# EAGLE board RectangularThing-SOICs (EAGLE 7.7.0), part 1 of 2
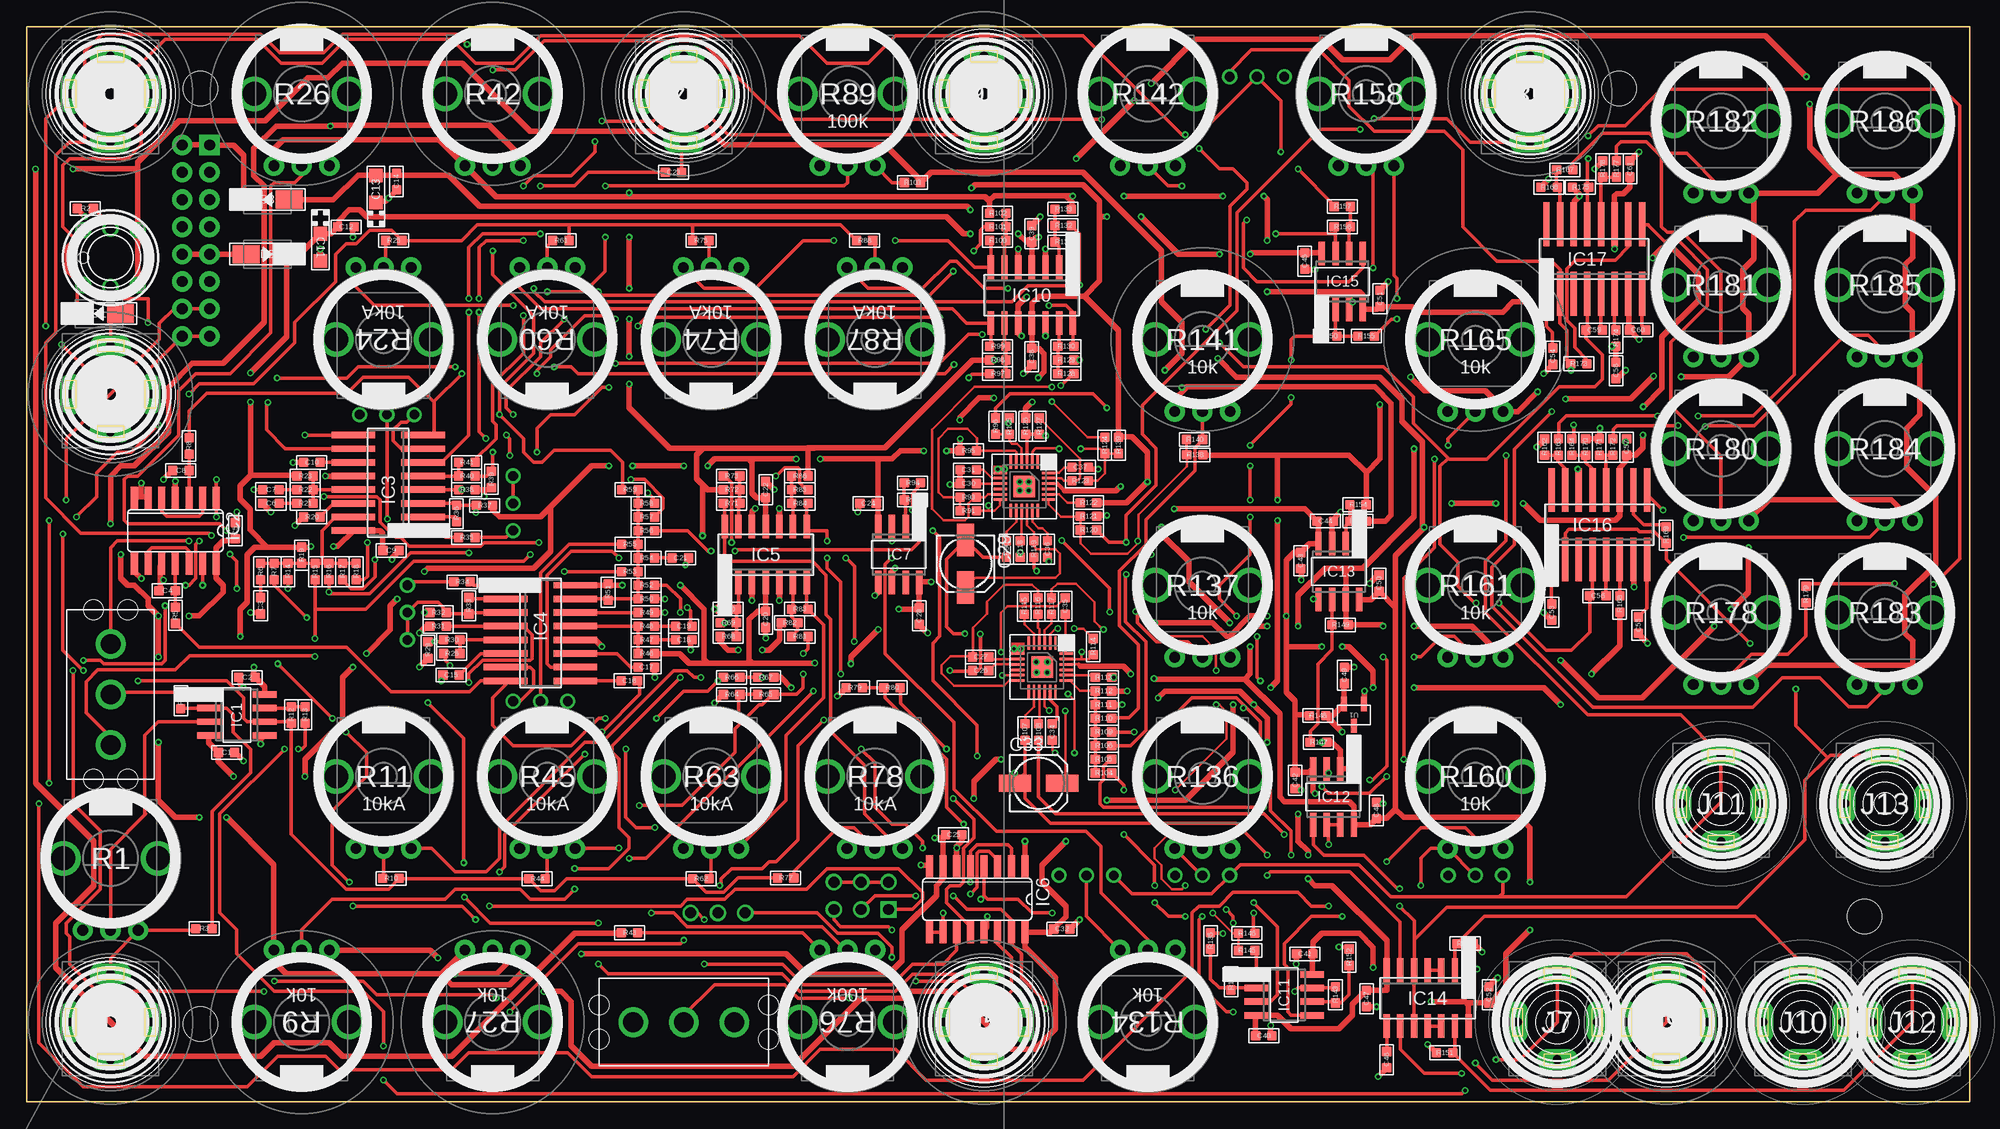
[diagram p9: board, top side]
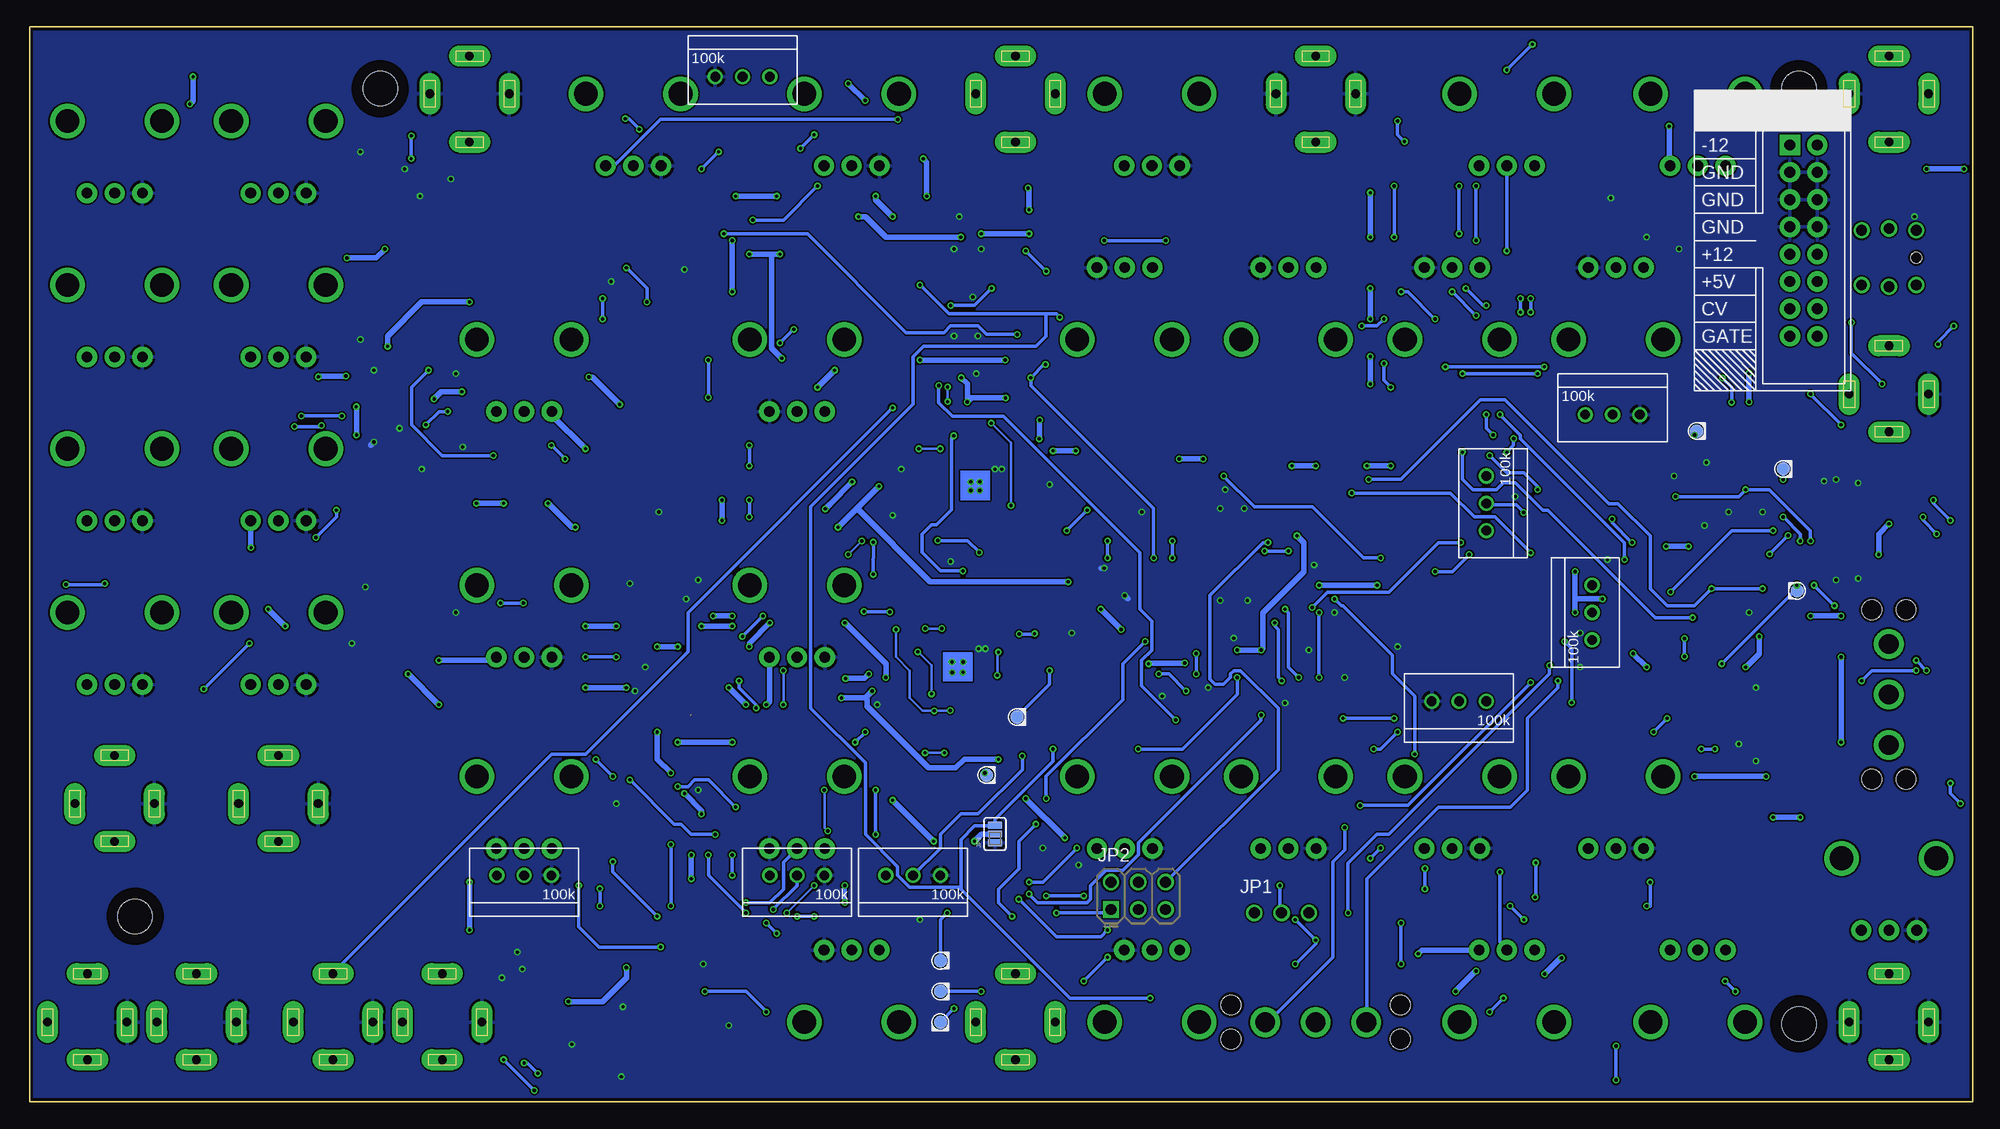
[diagram p10: board, bottom side, seen from below]

Size 180.78 x 100 mm. Coordinates in mm from the lower left corner, seen from the top.
Copper layers (1*16): Top 0.035mm / dielectric 1.5mm / Bottom 0.035mm
Design rules "ITEADstudio_DRC": minimum track width 6mil, minimum drill 12mil, track to track 6mil, track to pad 6mil, pad to pad 6mil, via to via 6mil, smd to smd 0mil, copper to edge 10mil, drill to drill 10mil, minimum pad ring 10mil, minimum via ring 6mil, stop-mask expansion 2mil, vias tented up to drill 100mil, thermal gap 10mil
Net classes: 0 default: width 0.305 mm; 1 power: width 0.508 mm; 2 nearfilter: width 0.254 mm; 3 groundplane: width 0.203 mm, clearance 0.203 mm

## Footprints (pad centres in the part's own frame; a part is rotated, then mirrored left to right if it is on the bottom)
C0603 = smd 0.889 x 0.889: 1 -0.762,0; 2 0.762,0
CASE-A_3216 = smd 1.27 x 1.27: + -1.27,0; - 1.27,0
153CLV-0505 = smd 3 x 1.6: + 2.2,0; - -2.2,0
DO-214AC = smd 2.5 x 1.7: 1 -2,0; 2 2,0
3.2-NOMARKINGS-SMALLSAFEZONE = hole 3.2: 0,0
SO08 = smd 0.6 x 2.2: 1 -1.905,-2.6; 2 -0.635,-2.6; 3 0.635,-2.6; 4 1.905,-2.6; 5 1.905,2.6; 6 0.635,2.6; 7 -0.635,2.6; 8 -1.905,2.6
SO14 = smd 0.66 x 2.032: 1 -3.81,-3.073; 2 -2.54,-3.073; 3 -1.27,-3.073; 4 0,-3.073; 5 1.27,-3.073; 6 2.54,-3.073; 7 3.81,-3.073; 8 3.81,3.073; 9 2.54,3.073; 10 1.27,3.073; 11 0,3.073; 12 -1.27,3.073; 13 -2.54,3.073; 14 -3.81,3.073
SO16 = smd 0.6 x 4.064: 1 -4.445,-3.235; 2 -3.175,-3.235; 3 -1.905,-3.235; 4 -0.635,-3.235; 5 0.635,-3.235; 6 1.905,-3.235; 7 3.175,-3.235; 8 4.445,-3.235; 9 4.445,3.235; 10 3.175,3.235; 11 1.905,3.235; 12 0.635,3.235; 13 -0.635,3.235; 14 -1.905,3.235; 15 -3.175,3.235; 16 -4.445,3.235
SO14' = smd 0.6 x 2.2: 1 -3.81,-2.6; 2 -2.54,-2.6; 3 -1.27,-2.6; 4 0,-2.6; 5 1.27,-2.6; 6 2.54,-2.6; 7 3.81,-2.6; 8 3.81,2.6; 9 2.54,2.6; 10 1.27,2.6; 11 0,2.6; 12 -1.27,2.6; 13 -2.54,2.6; 14 -3.81,2.6
SO16' = smd 0.66 x 2.032: 1 -4.445,-3.073; 2 -3.175,-3.073; 3 -1.905,-3.073; 4 -0.635,-3.073; 5 0.635,-3.073; 6 1.905,-3.073; 7 3.175,-3.073; 8 4.445,-3.073; 9 4.445,3.073; 10 3.175,3.073; 11 1.905,3.073; 12 0.635,3.073; 13 -0.635,3.073; 14 -1.905,3.073; 15 -3.175,3.073; 16 -4.445,3.073
QFN24 = smd 1.25 x 0.23: P$1 -2.25,1.25; P$2 -2.25,0.75; P$3 -2.25,0.25; P$4 -2.25,-0.25; P$5 -2.25,-0.75; P$6 -2.25,-1.25; P$13 2.25,-1.25; P$14 2.25,-0.75; P$15 2.25,-0.25; P$16 2.25,0.25; P$17 2.25,0.75; P$18 2.25,1.25 | smd 0.23 x 1.25: P$7 -1.25,-2.25; P$8 -0.75,-2.25; P$9 -0.25,-2.25; P$10 0.25,-2.25; P$11 0.75,-2.25; P$12 1.25,-2.25; P$19 1.25,2.25; P$20 0.75,2.25; P$21 0.25,2.25; P$22 -0.25,2.25; P$23 -0.75,2.25; P$24 -1.25,2.25 | smd 2 x 2: PAD 0,0
3.5MM-JACK-SWITCH-13MM-INPUT = drill 0.8 pad 1.93 long: RING@3 -3.7,0; SECOND@3 0,-3.5; SWITCH@3 3.7,0; TIP@3 0,4.5
3.5MM-JACK-SWITCH-13MM-OUTPUT = drill 0.8 pad 1.93 long: RING@3 -3.7,0; SECOND@3 0,-3.5; SWITCH@3 3.7,0; TIP@3 0,4.5
POWER_16_SHROUDED = drill 1.016 pad 1.88 square: 1 -8.89,-1.27 | drill 1.016 pad 1.88: 2 -8.89,1.27; 3 -6.35,-1.27; 4 -6.35,1.27; 5 -3.81,-1.27; 6 -3.81,1.27; 7 -1.27,-1.27; 8 -1.27,1.27; 9 1.27,-1.27; 10 1.27,1.27; 11 3.81,-1.27; 12 3.81,1.27; 13 6.35,-1.27; 14 6.35,1.27; 15 8.89,-1.27; 16 8.89,1.27
1X03_NO_SILK = drill 1.016: 1 0,0; 2 2.54,0; 3 5.08,0
2X3-NS = drill 1.016 square: 1 -2.54,-1.27 | drill 1.016: 2 -2.54,1.27; 3 0,-1.27; 4 0,1.27; 5 2.54,-1.27; 6 2.54,1.27
SJ_3_PASTE1&2 = smd 0.635 x 1.27: 1 -0.813,0; 2 0,0; 3 0.813,0
OG-POTS_ALPS_POT_VERTICAL = drill 1 pad 1.88: P$1 -2.58,-6.7; P$2 0,-6.7; P$3 2.58,-6.7 | drill 2.2 pad 3.175: P$4 4.4,0; P$5 -4.4,0
R0603 = smd 0.889 x 0.889: 1 -0.762,0; 2 0.762,0
OG-POTS_ALPS_POT_VERTICAL_WITHBIGKNOB = drill 1 pad 1.88: P$1 -2.58,-6.7; P$2 0,-6.7; P$3 2.58,-6.7 | drill 2.2 pad 3.175: P$4 4.4,0; P$5 -4.4,0
TRIMPOT = drill 0.9: P$1 -2.54,0; P$2 0,0; P$3 2.54,0
MULTICOMP1MS-ONOFFON = drill 1.85: 1 -4.7,0; 2 0,0; 3 4.7,0 | hole 1.85: -7.875,1.59; -7.875,-1.59; 7.875,1.59; 7.875,-1.59
PB6149L = drill 1: 1 2.54,2.54; 2 2.54,-2.54; 3 -2.54,2.54; 4 -2.54,-2.54; LEDNEG 0,-2.7; LEDPOS 0,2.7 | hole 1: 2.54,0
PAD.03X.05 = smd 1.27 x 1.27: P$1 0,0
SOT95P237X112-3N = smd 1.321 x 0.559: 1 -1.016,0.94; 2 -1.016,-0.94; 3 1.016,0

## Placement (x,y rotation side)
C1  100nF  [C0603]  18.58,32.5 0 top
C2  100nF  [C0603]  20.49,39.48 0 top
C3  0.01uF  [C0603]  21.76,46.15 90 top
C4  33p  [C0603]  13.06,47.55 180 top
C5  100nF  [C0603]  19.41,53.13 90 top
C6  0.01uF  [C0603]  22.71,55.67 0 top
C7  100nF  [C0603]  22.71,56.94 180 top
C8  33p  [C0603]  14.33,58.72 180 top
C9  100nF  [C0603]  33.89,51.29 180 top
C10  1000pF  [C0603]  26.52,59.48 180 top
C11  10uF  [CASE-A_3216]  27.31,79.49 270 top
C12  100nF  [C0603]  29.7,81.39 0 top
C13  10uF  [CASE-A_3216]  32.49,84.92 90 top
C14  100nF  [C0603]  34.39,85.61 270 top
C15  0.001uF  [C0603]  39.47,39.7 180 top
C16  0.001uF  [C0603]  56.05,39.16 180 top
C17  1000pF  [C0603]  57.64,40.43 0 top
C18  0.01uF  [C0603]  61.13,42.97 180 top
C19  100nF  [C0603]  61.13,44.24 0 top
C20  100nF  [C0603]  68.75,44.88 270 top
C21  0.01uF  [C0603]  60.81,50.59 180 top
C22  100nF  [C0603]  68.75,56.94 90 top
C23  0.001uF  [C0603]  60.18,86.47 0 top
C24  100nF  [C0603]  78.27,55.67 180 top
C25  100nF  [C0603]  86.24,24.84 180 top
C26  300pF  [C0603]  88.75,40.12 0 top
C27  300pF  [C0603]  88.75,41.39 180 top
C28  100nF  [C0603]  83.04,45.2 90 top
C29  1uF  [153CLV-0505]  87.35,50.05 270 top
C30  300pF  [C0603]  87.61,57.52 0 top
C31  300pF  [C0603]  87.61,58.79 0 top
C32  100nF  [C0603]  96.31,16.08 0 top
C33  1uF  [153CLV-0505]  94.15,29.64 0 top
C34  300pF  [C0603]  95.42,34.4 270 top
C35  300pF  [C0603]  96.62,46.12 90 top
C36  300pF  [C0603]  94.97,51.42 270 top
C37  300pF  [C0603]  98.02,59.04 0 top
C38  100nF  [C0603]  93.51,69.33 270 top
C39  100nF  [C0603]  93.51,80.76 90 top
C40  100nF  [C0603]  115.1,6.14 0 top
C41  100nF  [C0603]  118.91,13.76 0 top
C42  100nF  [C0603]  118.02,29.89 270 top
C43  100nF  [C0603]  118.53,50.34 270 top
C44  100nF  [C0603]  120.82,54.02 0 top
C45  100nF  [C0603]  118.91,78.22 90 top
C46  5nF  [C0603]  126.53,3.92 270 top
C47  100nF  [C0603]  124.66,9.6 270 top
C48  100nF  [C0603]  125.58,27.1 270 top
C49  100nF  [C0603]  122.6,39.67 270 top
C50  100nF  [C0603]  125.83,48.24 270 top
C51  100nF  [C0603]  125.9,74.72 90 top
C52  100nF  [C0603]  136.06,9.95 270 top
C53  0.039uF  [C0603]  141.9,45.55 90 top
C54  0.039uF  [C0603]  142,69.36 90 top
C55  0.02uF  [C0603]  149.96,44.34 90 top
C56  0.02uF  [C0603]  146.19,47.07 0 top
C57  100nF  [C0603]  148.85,60.91 270 top
C58  100nF  [C0603]  147.87,68.02 90 top
C59  0.02uF  [C0603]  145.84,71.8 0 top
C60  0.02uF  [C0603]  149.9,71.8 0 top
C61  100nF  [C0603]  149.17,86.79 90 top
D1  [DO-214AC]  6.71,73.33 180 top
D2  [DO-214AC]  22.39,78.85 0 top
D3  [DO-214AC]  22.39,83.93 180 top
H1  MOUNT-HOLE  [3.2-NOMARKINGS-SMALLSAFEZONE]  16.17,7.25 0 top
H2  MOUNT-HOLE  [3.2-NOMARKINGS-SMALLSAFEZONE]  16.17,94.25 0 top
H3  MOUNT-HOLE  [3.2-NOMARKINGS-SMALLSAFEZONE]  170.98,17.26 0 top
H4  MOUNT-HOLE  [3.2-NOMARKINGS-SMALLSAFEZONE]  148.17,94.25 0 top
IC1  TL072  [SO08]  19.54,35.99 270 top
IC2  4013D  [SO14]  13.82,53.13 180 top
IC3  CEM3340SOIC16  [SO16]  33.63,57.58 90 top
IC4  CEM3340SOIC16  [SO16]  47.79,43.61 270 top
IC5  TL074D  [SO14']  68.75,50.91 0 top
IC6  4053D  [SO16']  88.43,18.84 180 top
IC7  TL072  [SO08]  81.13,50.91 180 top
IC8  CEM3320_UNFOLDEDQFN  [QFN24]  94.47,40.43 270 top
IC9  CEM3320QFN24  [QFN24]  92.81,57.26 270 top
IC10  TL074D  [SO14']  93.51,75.04 180 top
IC11  TL072  [SO08]  117.01,9.95 270 top
IC12  TL072  [SO08]  121.58,28.37 180 top
IC13  TL072  [SO08]  122.09,49.32 180 top
IC14  CEM3360SOIC14  [SO14']  130.34,9.64 180 top
IC15  TL072  [SO08]  122.41,76.31 0 top
IC16  CEM3310SOIC16  [SO16]  146.31,53.67 0 top
IC17  CEM3310SOIC16  [SO16]  145.84,78.41 0 top
J1  PJ-341  [3.5MM-JACK-SWITCH-13MM-INPUT]  7.79,7.41 0 top
J2  PJ-341  [3.5MM-JACK-SWITCH-13MM-INPUT]  7.79,65.83 0 top
J3  PJ-341  [3.5MM-JACK-SWITCH-13MM-INPUT]  7.79,93.77 180 top
J4  PJ-341  [3.5MM-JACK-SWITCH-13MM-INPUT]  61.13,93.77 180 top
J5  PJ-341  [3.5MM-JACK-SWITCH-13MM-INPUT]  89.07,7.41 0 top
J6  PJ-341  [3.5MM-JACK-SWITCH-13MM-INPUT]  89.07,93.77 180 top
J7  PJ-341  [3.5MM-JACK-SWITCH-13MM-OUTPUT]  142.41,7.41 0 top
J8  PJ-341  [3.5MM-JACK-SWITCH-13MM-INPUT]  139.87,93.77 180 top
J9  PJ-341  [3.5MM-JACK-SWITCH-13MM-INPUT]  152.57,7.41 0 top
J10  PJ-341  [3.5MM-JACK-SWITCH-13MM-OUTPUT]  165.27,7.41 0 top
J11  PJ-341  [3.5MM-JACK-SWITCH-13MM-OUTPUT]  157.65,27.73 0 top
J12  PJ-341  [3.5MM-JACK-SWITCH-13MM-OUTPUT]  175.43,7.41 0 top
J13  PJ-341  [3.5MM-JACK-SWITCH-13MM-OUTPUT]  172.89,27.73 0 top
J14  POWERSHROUDED  [POWER_16_SHROUDED]  15.73,80.12 270 bottom
JP1  [1X03_NO_SILK]  66.84,17.57 0 bottom
JP2  [2X3-NS]  77.64,19.16 0 bottom
JP3  JUMPER-31-2  [SJ_3_PASTE1&2]  90.97,24.91 90 bottom
PCB1  EURORACK_PCB36HP_10CM  [EURORACK36HP]  -0.34,-3 0 top
R1  [OG-POTS_ALPS_POT_VERTICAL]  7.79,22.65 0 top
R2  1k  [R0603]  5.44,83.11 180 top
R3  22k  [R0603]  16.49,16.11 0 top
R4  22k  [R0603]  14.33,37.32 90 top
R5  10k  [R0603]  13.82,45.26 90 top
R6  470  [R0603]  21.76,49.32 270 top
R7  100k  [R0603]  23.03,49.32 90 top
R8  10k  [R0603]  15.09,61.01 270 top
R9  10k  [OG-POTS_ALPS_POT_VERTICAL_WITHBIGKNOB]  25.57,7.41 180 top
R10  100k  [R0603]  33.88,20.79 0 top
R11  10kA  [OG-POTS_ALPS_POT_VERTICAL]  33.19,30.27 0 top
R12  100k  [R0603]  24.62,35.99 90 top
R13  100  [R0603]  25.89,35.99 270 top
R14  100k  [R0603]  24.3,49.32 90 top
R15  100k  [R0603]  26.84,49.32 90 top
R16  1M 0.1%  [R0603]  28.11,49.32 90 top
R17  100k 0.1%  [R0603]  29.38,49.32 90 top
R18  1M  [R0603]  30.65,49.32 270 top
R19  360k  [R0603]  25.57,50.85 270 top
R20  1.8k  [R0603]  26.52,54.4 0 top
R21  470  [R0603]  25.89,55.67 180 top
R22  1M  [R0603]  25.89,56.94 0 top
R23  1.5M  [R0603]  25.89,58.21 0 top
R24  10kA  [OG-POTS_ALPS_POT_VERTICAL]  33.19,70.91 180 top
R25  100k  [R0603]  34.14,80.12 0 top
R26  [OG-POTS_ALPS_POT_VERTICAL_WITHBIGKNOB]  25.57,93.77 0 top
R27  10k  [OG-POTS_ALPS_POT_VERTICAL_WITHBIGKNOB]  43.35,7.41 180 top
R28  100k  [R0603]  39.54,41.7 180 top
R29  100k  [R0603]  37.32,42.02 270 top
R30  560k  [R0603]  39.54,42.97 0 top
R31  10k  [R0603]  38.27,44.24 180 top
R32  820  [R0603]  38.27,45.51 180 top
R33  5.6k  [R0603]  41.13,46.15 270 top
R34  24k  [R0603]  40.49,48.37 180 top
R35  24k  [R0603]  40.94,52.5 0 top
R36  5.6k  [R0603]  39.98,54.72 90 top
R37  820  [R0603]  42.59,55.48 0 top
R38  10k  [R0603]  40.94,56.94 0 top
R39  100k  [R0603]  43.22,57.9 270 top
R40  560k  [R0603]  40.94,58.21 180 top
R41  100k  [R0603]  40.94,59.48 0 top
R42  [OG-POTS_ALPS_POT_VERTICAL_WITHBIGKNOB]  43.35,93.77 0 top
R43  140k  [R0603]  56.08,15.73 180 top
R44  100k  [R0603]  47.48,20.75 180 top
R45  10kA  [OG-POTS_ALPS_POT_VERTICAL]  48.43,30.27 0 top
R46  1.5M  [R0603]  57.64,41.7 180 top
R47  470  [R0603]  57.64,42.97 0 top
R48  1M  [R0603]  57.64,44.24 180 top
R49  1.8k  [R0603]  57.64,45.51 180 top
R50  100k  [R0603]  57.64,46.78 180 top
R51  360k  [R0603]  54.08,47.42 270 top
R52  1M  [R0603]  57.64,48.05 180 top
R53  100k  [R0603]  56.11,49.32 0 top
R54  470  [R0603]  57.64,50.59 0 top
R55  1M  [R0603]  56.11,51.86 180 top
R56  100k  [R0603]  57.64,53.13 180 top
R57  100k  [R0603]  57.64,54.4 180 top
R58  1M 0.1%  [R0603]  57.64,55.67 180 top
R59  100k 0.1%  [R0603]  56.11,56.94 0 top
R60  10kA  [OG-POTS_ALPS_POT_VERTICAL]  48.43,70.91 180 top
R61  100k  [R0603]  49.7,80.12 0 top
R62  100k  [R0603]  62.72,20.75 180 top
R63  10kA  [OG-POTS_ALPS_POT_VERTICAL]  63.67,30.27 0 top
R64  100k  [R0603]  65.57,37.89 0 top
R65  100k  [R0603]  68.75,37.89 0 top
R66  100k  [R0603]  65.57,39.48 180 top
R67  100k  [R0603]  68.75,39.48 180 top
R68  10k  [R0603]  65.26,43.29 0 top
R69  10k  [R0603]  65.26,44.56 0 top
R70  10k  [R0603]  65.26,45.83 180 top
R71  20k  [R0603]  65.57,55.67 180 top
R72  20k  [R0603]  65.57,56.94 0 top
R73  10k  [R0603]  65.57,58.21 0 top
R74  10kA  [OG-POTS_ALPS_POT_VERTICAL]  63.67,70.91 180 top
R75  100k  [R0603]  62.72,80.12 180 top
R76  100k  [OG-POTS_ALPS_POT_VERTICAL]  76.37,7.41 180 top
R77  100k  [R0603]  70.61,20.83 180 top
R78  10kA  [OG-POTS_ALPS_POT_VERTICAL]  78.91,30.27 0 top
R79  100k  [R0603]  77,38.53 0 top
R80  100k  [R0603]  80.5,38.53 0 top
R81  10k  [R0603]  71.92,43.29 180 top
R82  10k  [R0603]  70.97,44.56 0 top
R83  10k  [R0603]  71.92,45.83 0 top
R84  20k  [R0603]  71.92,55.67 0 top
R85  10k  [R0603]  71.92,56.94 180 top
R86  20k  [R0603]  71.92,58.21 180 top
R87  10kA  [OG-POTS_ALPS_POT_VERTICAL]  78.91,70.91 180 top
R88  100k  [R0603]  77.96,80.12 180 top
R89  100k  [OG-POTS_ALPS_POT_VERTICAL]  76.37,93.77 0 top
R90  51k  [R0603]  91.16,51.42 90 top
R91  91k  [R0603]  87.61,54.98 0 top
R92  22k  [R0603]  82.4,55.99 0 top
R93  100k  [R0603]  87.61,56.25 0 top
R94  22k  [R0603]  82.4,57.58 180 top
R95  220k  [R0603]  87.61,60.56 0 top
R96  91k  [R0603]  90.15,62.85 90 top
R97  10k  [R0603]  90.34,67.74 0 top
R98  20k  [R0603]  90.34,69.01 0 top
R99  20k  [R0603]  90.34,70.28 180 top
R100  10k  [R0603]  90.34,80.12 180 top
R101  10k  [R0603]  90.34,81.39 0 top
R102  10k  [R0603]  90.34,82.66 0 top
R103  140k  [R0603]  82.4,85.52 0 top
R104  100k  [R0603]  100.18,30.59 180 top
R105  100k  [R0603]  100.18,31.86 180 top
R106  100k  [R0603]  100.18,33.13 180 top
R107  51k  [R0603]  92.88,34.4 90 top
R108  100k  [R0603]  94.15,34.4 270 top
R109  100k  [R0603]  100.18,34.4 180 top
R110  100k  [R0603]  100.18,35.67 180 top
R111  1.8k  [R0603]  100.18,36.94 0 top
R112  BIAS  [R0603]  100.18,38.21 0 top
R113  1.8k  [R0603]  100.18,39.48 0 top
R114  100k  [R0603]  99.23,42.34 270 top
R115  100k  [R0603]  92.81,46.12 90 top
R116  100k  [R0603]  94.08,46.12 90 top
R117  100k  [R0603]  95.35,46.12 90 top
R118  100k  [R0603]  92.43,51.42 270 top
R119  100k  [R0603]  93.7,51.42 270 top
R120  100k  [R0603]  98.78,53.2 180 top
R121  1.8k  [R0603]  98.78,54.47 0 top
R122  1.8k  [R0603]  98.78,55.74 180 top
R123  100k  [R0603]  98.02,57.77 0 top
R124  91k  [R0603]  100.31,61.07 270 top
R125  100k  [R0603]  91.42,62.85 90 top
R126  220k  [R0603]  92.94,62.85 90 top
R127  91k  [R0603]  94.21,62.85 270 top
R128  10k  [R0603]  96.69,67.74 180 top
R129  20k  [R0603]  96.69,69.01 180 top
R130  20k  [R0603]  96.69,70.28 0 top
R131  10k  [R0603]  96.43,79.99 0 top
R132  10k  [R0603]  96.43,81.52 180 top
R133  10k  [R0603]  96.43,83.04 180 top
R134  10k  [OG-POTS_ALPS_POT_VERTICAL]  104.31,7.41 180 top
R135  22k  [R0603]  110.15,14.97 270 top
R136  [OG-POTS_ALPS_POT_VERTICAL]  109.39,30.27 0 top
R137  10k  [OG-POTS_ALPS_POT_VERTICAL]  109.39,48.05 0 top
R138  BIAS  [R0603]  108.69,60.18 180 top
R139  220k  [R0603]  101.58,61.07 90 top
R140  100k  [R0603]  108.66,61.61 180 top
R141  10k  [OG-POTS_ALPS_POT_VERTICAL_WITHBIGKNOB]  109.39,70.91 0 top
R142  [OG-POTS_ALPS_POT_VERTICAL]  104.31,93.77 0 top
R143  22k  [R0603]  121.77,9.95 90 top
R144  22k  [R0603]  112.06,11.16 90 top
R145  100k  [R0603]  113.52,14.08 180 top
R146  100k  [R0603]  113.52,15.67 180 top
R147  100k  [R0603]  120.18,33.45 180 top
R148  10k  [R0603]  120.12,35.93 0 top
R149  100k  [R0603]  122.22,44.37 0 top
R150  22k  [R0603]  121.14,71.23 180 top
R151  47k  [R0603]  131.93,4.56 180 top
R152  22k  [R0603]  123.04,13.45 270 top
R153  200k  [R0603]  123.87,54.02 0 top
R154  100k  [R0603]  123.87,55.55 180 top
R155  22k  [R0603]  124.63,71.23 180 top
R156  22k  [R0603]  122.41,81.39 180 top
R157  22k  [R0603]  122.41,83.3 0 top
R158  [OG-POTS_ALPS_POT_VERTICAL]  124.63,93.77 0 top
R159  47k  [R0603]  133.84,14.72 0 top
R160  10k  [OG-POTS_ALPS_POT_VERTICAL]  134.79,30.27 0 top
R161  10k  [OG-POTS_ALPS_POT_VERTICAL]  134.79,48.05 0 top
R162  470  [R0603]  141.23,60.91 90 top
R163  10k  [R0603]  142.5,60.91 90 top
R164  10k  [R0603]  143.77,60.91 90 top
R165  10k  [OG-POTS_ALPS_POT_VERTICAL_WITHBIGKNOB]  134.79,70.91 0 top
R166  470  [R0603]  141.65,85.07 180 top
R167  10k  [R0603]  143.11,86.69 0 top
R168  470  [R0603]  148.22,46.31 270 top
R169  24k  [R0603]  152.54,52.72 270 top
R170  470  [R0603]  145.04,60.91 90 top
R171  470  [R0603]  146.31,60.91 270 top
R172  10k  [R0603]  147.58,60.91 90 top
R173  24k  [R0603]  144.41,68.66 180 top
R174  470  [R0603]  147.87,71.04 270 top
R175  470  [R0603]  144.57,85.07 180 top
R176  470  [R0603]  146.63,86.79 270 top
R177  10k  [R0603]  147.9,86.79 90 top
R178  [OG-POTS_ALPS_POT_VERTICAL]  157.65,45.51 0 top
R179  10k  [R0603]  165.55,47.2 270 top
R180  [OG-POTS_ALPS_POT_VERTICAL]  157.65,60.75 0 top
R181  [OG-POTS_ALPS_POT_VERTICAL]  157.65,75.99 0 top
R182  [OG-POTS_ALPS_POT_VERTICAL]  157.65,91.23 0 top
R183  [OG-POTS_ALPS_POT_VERTICAL]  172.89,45.51 0 top
R184  [OG-POTS_ALPS_POT_VERTICAL]  172.89,60.75 0 top
R185  [OG-POTS_ALPS_POT_VERTICAL]  172.89,75.99 0 top
R186  [OG-POTS_ALPS_POT_VERTICAL]  172.89,91.23 0 top
R187  100k  [TRIMPOT]  35.41,45.51 90 bottom
R188  100k  [TRIMPOT]  33.51,63.93 0 bottom
R189  100k  [TRIMPOT]  47.79,37.26 180 bottom
R190  100k  [TRIMPOT]  45.25,55.67 270 bottom
R191  100k  [TRIMPOT]  98.59,21.07 180 bottom
R192  100k  [TRIMPOT]  109.39,21.07 180 bottom
R193  100k  [TRIMPOT]  114.47,95.36 0 bottom
R194  100k  [TRIMPOT]  134.79,21.07 180 bottom
S1  ONOFFON  [MULTICOMP1MS-ONOFFON]  7.79,37.89 270 top
S2  SWITCH_W_LED_PB6149L-X-102YELLOW  [PB6149L]  7.79,78.53 180 top
S3  ONOFFON  [MULTICOMP1MS-ONOFFON]  61.13,7.41 180 top
TP1  TEST-POINT3X5  [PAD.03X.05]  16.33,47.55 90 bottom
TP2  TEST-POINT3X5  [PAD.03X.05]  17.63,58.88 270 bottom
TP3  TEST-POINT3X5  [PAD.03X.05]  25.69,62.4 270 bottom
TP4  TEST-POINT3X5  [PAD.03X.05]  96.05,7.41 180 bottom
TP5  TEST-POINT3X5  [PAD.03X.05]  96.05,10.27 270 bottom
TP6  TEST-POINT3X5  [PAD.03X.05]  96.05,13.13 270 bottom
TP7  TEST-POINT3X5  [PAD.03X.05]  91.77,30.4 270 bottom
TP8  TEST-POINT3X5  [PAD.03X.05]  88.94,35.8 270 bottom
U1  LM4040DIM3-5.0  [SOT95P237X112-3N]  123.48,35.99 270 top

## Tracks (layer width: path | path; a pad name or v marks a point on that pad's centre or on a via)
5V  (via drill 0.3)
  Top 0.508: R42.P$3 45.93,87.95 43.03,90.85 28.33,90.85 v28.23,90.76 23.19,90.76 21.12,88.69 21.12,86.15 22.07,85.2 22.07,72.5 18.27,68.69 15.41,68.69 13.19,66.47 13.19,62.34 10.01,59.17 8.74,59.17 7.79,58.21 v7.79,53.77 | 38.58,11.92 24.14,11.92 22.99,13.07 R9.P$3 22.99,22.06 v18.58,26.46 | 38.58,11.92 R27.P$3 | R180.P$3 160.23,54.13 162.12,56.02 173.5,56.02 R184.P$3 | C5.1 19.22,52.18 18.27,52.18 17.63,51.55 IC2.14 17.63,48.69 18.27,48.05 18.27,47.42 16.04,45.2 v15.09,45.2 | v96.69,24.24 94.47,22.02 94.47,20.43 96.69,18.21 96.69,17.23 C32.1 95.23,15.77 IC6.16 92.88,14.4 95.73,11.54 95.73,6.78 93.83,4.87 91.61,4.87 86.21,10.27 82.08,10.27 81.45,9.64 77.64,9.64 71.29,3.29 52.56,3.29 50.65,5.19 50.65,9.32 49.7,10.27 v48.11,10.27 | v100.5,28.05 107.8,28.05 112.25,32.5 v112.25,36.94 | v129.07,60.75 129.07,54.4 124.31,49.64 123.04,49.64 | 123.04,49.64 122.72,49.32 IC13.7 122.72,44.62 R149.2 126.09,44.37 v126.22,44.24 | R137.P$3 111.97,42.06 114.15,44.24 v115.42,44.24 | v118.28,44.24 118.28,47.1 120.82,49.64 123.04,49.64 | v129.07,44.24 134.48,44.24 R161.P$3 | v160.19,51.55 160.19,47.42 v158.6,45.83 | v157.01,44.24 150.35,37.58 146.22,37.58 v142.73,41.07 | v8.74,50.91 8.74,48.69 9.38,48.05 10.01,48.05 11.28,46.78 11.28,46.15 v12.23,45.2 v12.23,41.39 | v16.04,26.46 13.82,26.46 12.23,28.05 v12.23,33.45 | v46.21,12.18 44.94,10.91 39.54,10.91 38.59,11.86 38.58,11.92
  Bottom 0.508: v28.23,90.76 28.23,87.16 R26.P$3 | v96.69,24.24 v100.5,28.05 | v112.25,36.94 111.97,37.22 R137.P$3 | R165.P$1 132.21,63.89 v129.07,60.75 | v115.42,44.24 v118.28,44.24 | v126.22,44.24 v129.07,44.24 | R180.P$3 160.23,51.59 v160.19,51.55 | v158.6,45.83 v157.01,44.24 | v142.73,41.07 137.65,41.07 R161.P$3 | v15.09,45.2 v12.23,45.2 | v8.74,50.91 8.74,52.82 v7.79,53.77 | v18.58,26.46 v16.04,26.46 | v12.23,33.45 v12.23,41.39 | v48.11,10.27 v46.21,12.18
10V  (via drill 0.3)
  Top 0.508: IC13.1 123.99,53.39 R153.2 126.41,54.02 126.95,54.56 126.95,65.01 125.45,66.5 107.96,66.5 107.71,66.25 | S2.3 S2.4 10.33,86.79 | R141.P$1 106.81,65.35 107.71,66.25 | v105.9,68.06 107.48,69.64 107.48,72.5 105.58,74.41 105.58,79.17 98.28,86.47 84.12,86.47 R103.2 83.16,85.71 79.86,89.01 64.94,89.01 63.03,90.92 59.22,90.92 58.59,90.28 46.84,90.28 40.49,96.63 29.38,96.63 28,95.25 26.17,95.25 22.17,91.25 14.17,91.25 10.34,87.42 10.33,87.42 10.33,86.79 | v107.48,66.47 107.8,66.47 107.71,66.25 | R43.2 55.25,15.67 50.97,15.67 39.54,4.24 29.38,4.24 28.11,5.51 23.03,5.51 21.76,4.24 10.96,4.24 2.71,12.49 2.71,16.62 6.2,20.11 6.2,24.24 0.8,29.64 v0.8,86.79 | v4.3,86.79 10.33,86.79
  Bottom 0.508: v105.9,68.06 v107.48,66.47 | v0.8,86.79 v4.3,86.79
12V  (via drill 0.3)
  Top 0.254: IC9.P$22 95.9,57.51 | IC8.P$22 97.87,40.68
  Top 0.356: 95.9,57.51 96.56,56.85
  Top 0.381: 97.87,40.68 98.05,40.5
  Top 0.508: IC4.16 53.95,48.05 | 53.95,48.05 R51.1 | IC14.14 134.15,9 | 134.15,9 134.15,9.19 C52.2 136.25,9.19 137.65,10.59 137.65,13.76 v139.87,15.99 | C9.2 33.12,52.88 32.87,53.13 IC3.16 28.94,51.67 v28.52,51.67 | IC13.8 125.08,46.72 C50.2 127.36,45.96 | IC10.4 C39.1 | 98.05,40.5 102.02,40.5 v102.72,39.8 | IC5.4 C20.1 67.99,45.64 67.22,44.88 67.22,41.07 67.48,40.81 | R46.1 60.75,41.7 61.64,40.81 63.35,40.81 | R23.1 25.06,58.28 20.84,58.28 | 20.84,58.28 19.85,57.29 19.85,56.05 20.77,55.13 20.77,53.2 22.36,51.61 | 22.36,51.61 R19.1 26.36,51.61 v26.43,51.67 | 127.36,45.96 127.36,27.23 | 127.36,27.23 126.5,26.37 125.61,26.37 C48.2 125.01,25.77 IC12.8 123.48,27.51 123.07,27.93 117.04,27.93 116.6,28.37 116.6,36.08 113.36,39.32 | v104.88,39.39 104.94,39.32 113.36,39.32 | C61.1 149.17,85.07 148.57,84.47 147.93,84.47 147.74,84.28 IC17.11 v147.74,79.33 | D2.2 24.95,78.87 | 24.95,78.87 25.44,78.88 C11.+ 28.3,80.76 C12.1 29.06,81.52 29.06,82.03 30.01,82.98 30.96,82.98 31.6,82.34 85.58,82.34 87.16,80.76 v87.8,80.76 | v20.8,67.8 24.17,71.17 24.17,78.09 24.95,78.87 | v20.8,65.1 20.8,58.31 20.84,58.28 | 63.35,40.81 67.48,40.81 | 67.48,40.81 v73.32,40.81 | v150.38,62.02 150.38,60.85 149.68,60.15 C57.2 148.79,60.09 148.79,59.58 148.22,59.01 IC16.11 148.22,54.5 147.81,54.09 140.82,54.09 v139.23,55.67 | v150.41,64.66 150.44,64.66 152.16,66.37 152.16,71.17 155.52,74.53 155.52,77.04 153.17,79.39 152.16,79.39 v151.27,78.5 | 53.95,48.05 v55.41,48.05 | v60.81,48.05 63.03,45.83 63.03,41.13 63.35,40.81 | 127.36,27.23 128.12,26.46 138.92,26.46 139.87,25.51 v139.87,20.43 | 127.36,45.96 127.36,50.78 v130.03,53.45 129.87,53.61 129.87,61.39 127.96,63.29 127.96,65.36 125.9,67.42 112.56,67.42 v110.82,69.17
  Top 0.508: v132.57,55.67 v136.69,55.67 | 113.36,39.32 113.83,39.8 v113.83,42.34 | v111.93,44.56 108.12,48.37 108.12,50.28 105.58,52.82 v105.58,53.45 | 96.56,56.85 101.36,56.85 v101.77,57.26 | IC11.8 119.61,13.7 C41.2 119.68,14.84 120.5,15.67 123.99,15.67 125.26,14.4 v125.26,12.49 | v110.98,78.85 107.17,78.85 v103.67,82.34 | v94.15,80.44 93.96,80.44 C39.1 | IC1.8 22.14,38.6 C2.2 21.12,39.61 v21.12,40.43 | 22.36,51.61 21.19,51.61 20.49,50.91 20.49,46.47 19.85,45.83 v19.85,43.29 | v113.83,78.85 113.96,78.98 C45.2 120.43,78.98 IC15.8 | v130.66,9.32 133.84,9.32 134.15,9 | v81.13,45.83 82.91,45.83 C28.2 IC7.8 83.19,48.37 v84.15,48.37 | C39.1 93.01,79.99 v92.24,80.76 | v76.69,40.75 76.69,41.39 v79.23,43.93
  Bottom 0.508: v28.52,51.67 v26.43,51.67 | v20.8,67.8 v20.8,65.1 | v150.38,62.02 150.38,64.63 v150.41,64.66 | v151.27,78.5 148.57,78.5 v147.74,79.33 | v55.41,48.05 v60.81,48.05 | v139.87,20.43 v139.87,15.99 | v130.03,53.45 130.34,53.45 v132.57,55.67 | v136.69,55.67 v139.23,55.67 | v113.83,42.34 113.83,42.66 v111.93,44.56 | v105.58,53.45 103.83,55.2 | 103.83,55.2 v101.77,57.26 | v113.83,78.85 111.77,78.85 | 111.77,78.85 v110.98,78.85 | v103.67,82.34 103.04,82.34 101.13,80.44 v94.15,80.44 | v19.85,43.29 19.85,41.7 v21.12,40.43 | v125.26,12.49 125.26,11.54 127.48,9.32 v130.66,9.32 | v81.13,45.83 v79.23,43.93 | v102.72,39.8 103.13,39.39 v104.88,39.39 | v92.24,80.76 v87.8,80.76 | v73.32,40.81 76.62,40.81 v76.69,40.75 | v84.15,48.37 97.01,48.37 103.83,55.2 | v110.82,69.17 111.77,70.12 111.77,78.85
-5V  (via drill 0.3)
  Top 0.508: IC12.1 IC12.2 122.22,32.69 121.45,33.45 R147.1 v120.5,33.45 | 168.41,86.28 166.66,84.53 R182.P$3 160.7,84.07 160.7,78.41 159.68,77.39 159.68,73.8 160.23,73.26 R181.P$3 158.39,67.45 v153.93,67.45 | 168.41,86.28 173.72,86.28 R186.P$3 175.47,78.57 174.79,77.9 174.79,74.09 175.43,73.45 175.43,69.33 R185.P$3 176.16,68.6 176.16,63.9 174.92,62.66 174.92,58.98 177.62,56.28 177.62,49.96 174.76,47.1 174.76,43.58 175.47,42.87 175.47,40.62 | R183.P$3 175.47,40.62 | R178.P$3 160.23,38.98 161.87,40.62 175.47,40.62 | R26.P$1 22.99,88.62 23.85,89.49 38.35,89.49 R42.P$1 43.67,84.19 56.05,84.19 | R9.P$1 37.51,14.11 v38.24,13.38 | v39.82,11.89 43.7,11.89 R27.P$1 | R86.1 72.69,60.85 73.29,60.85 | 73.29,60.85 79.86,60.85 87.99,68.98 89.54,68.98 R98.1 v90.02,69.01 | 63.02,57.25 63.32,56.94 R72.1 | 63.02,57.25 62.3,57.96 62.3,60.21 62.91,60.82 | 62.91,60.82 73.26,60.82 73.29,60.85 | 56.05,84.19 89.16,84.19 | R102.1 89.58,83.77 89.16,84.19 | R154.1 124.63,58.53 | 124.63,58.53 124.63,58.56 123.04,60.15 116.37,60.15 | 116.37,60.15 109.48,60.15 R138.1 | 89.16,84.19 89.58,83.87 90.02,84.31 96.62,84.31 | 96.62,84.31 97.23,83.71 97.23,83.07 R133.1 | v51.6,13.76 70.65,13.76 72.56,11.86 80.18,11.86 81.45,13.13 81.45,15.99 84.62,19.16 84.62,20.11 85.26,20.75 IC6.7 85.26,24.62 C25.2 85.1,24.56 v84.46,24.56 | v140.57,66.06 138.72,64.21 R165.P$3 137.37,64.52 135.74,66.15 130.03,66.15 v128.76,67.42 | v143.17,65.39 149.23,65.39 v151.36,67.52 | v125.9,64.88 125.9,59.8 124.63,58.53 | v56.05,66.79 56.05,64.56 59.8,60.82 62.91,60.82 | v56.05,69.33 v56.05,72.82 | v56.05,75.68 v56.05,80.44 | v56.05,84.57 56.05,84.19
  Top 0.508: R112.2 v102.4,38.21 | v105.26,37.58 105.9,38.21 112.88,38.21 v114.15,36.94 115.42,35.67 v115.42,33.45 | v115.74,38.53 116.37,39.16 v116.37,54.09 | v116.37,55.99 116.37,60.15 | 96.62,84.31 97.26,84.31 v97.32,84.25 | v97.64,87.74 v103.04,93.14 | v104.62,94.73 108.75,98.85 120.5,98.85 122.41,96.95 126.85,96.95 129.07,99.17 161.78,99.17 v165.59,95.36 | v165.9,92.82 165.9,88.79 168.41,86.28 | R68.1 64.49,42.78 65.26,42.02 v66.21,42.02 | v68.43,42.02 69.07,42.02 70.02,42.97 70.02,44.37 R82.1 | v97.96,69.01 R129.1 | v62.87,52.66 62.87,57.1 63.02,57.25 | v88.12,28.21 88.12,29.8 90.18,31.86 v90.66,31.86
  Bottom 0.508: v38.24,13.38 38.33,13.38 v39.82,11.89 | R27.P$1 51.25,14.11 v51.6,13.76 | v140.57,66.06 142.5,66.06 v143.17,65.39 | v151.36,67.52 153.87,67.52 v153.93,67.45 | v128.76,67.42 128.44,67.42 v125.9,64.88 | v56.05,66.79 v56.05,69.33 | v56.05,72.82 v56.05,75.68 | v56.05,80.44 v56.05,84.57 | v102.4,38.21 103.04,37.58 | 103.04,37.58 v105.26,37.58 | v115.42,33.45 v120.5,33.45 | v114.15,36.94 v115.74,38.53 | v116.37,54.09 v116.37,55.99 | v97.32,84.25 97.32,87.42 v97.64,87.74 | v103.04,93.14 v104.62,94.73 | v165.59,95.36 165.59,93.14 v165.9,92.82 | v68.43,42.02 v66.21,42.02 66.05,42.18 66.05,45.51 62.24,49.32 62.24,52.02 v62.87,52.66 | v90.02,69.01 v97.96,69.01 | v84.46,24.56 v88.12,28.21 | 103.04,37.58 102.88,37.42 102.88,36.78 97.16,31.07 94.62,31.07 93.83,31.86 v90.66,31.86
-5VIN  (via drill 0.3)
  Top 0.508: C49.2 122.55,38.86 U1.2 121.47,35.93 R148.2 v122.41,34.4 | v121.14,30.59 120.95,30.78 IC12.3
  Bottom 0.508: v122.41,34.4 122.41,31.86 v121.14,30.59
-12V  (via drill 0.3)  (1 unrouted)
  Top 0.508: IC5.11 C22.1 67.92,56.18 67.48,56.63 67.48,59.48 67.16,59.8 | IC10.11 93.51,71.93 | 93.51,71.93 C38.1 93.55,70.06 94.21,70.06 94.66,69.61 94.66,67.9 v94.12,67.36 | 117.2,42.34 v117.2,45.2 117.2,50.37 117.93,51.1 C43.1 119.35,51.92 IC13.4 120.18,53.9 C44.1 118.91,55.17 v106.75,55.17 | 117.2,42.34 117.2,38.09 117.99,37.29 117.99,35.99 | R122.1 102.34,55.74 v104.28,57.67 104.28,60.44 102.85,61.87 101.61,61.87 R139.2 101.58,71.77 98.4,74.95 | 98.4,74.95 94.21,74.95 93.55,74.28 93.55,71.96 93.51,71.93 | R126.2 92.94,64.5 v93.55,65.1 | D3.1 28.52,83.93 30.81,86.22 32.46,86.22 C13.- 34.2,86.19 | 34.2,86.19 C14.1 | 34.2,86.19 39.25,86.19 42.14,83.3 87.48,83.3 v87.8,82.98 | v87.89,85.01 87.93,85.01 88.24,85.33 98.28,85.33 99.83,83.77 99.83,82.34 | 99.83,82.34 99.83,76.38 98.4,74.95 | v86.85,61.68 R95.1 v85.58,60.56 | v86.81,63.42 86.81,63.71 88.59,65.48 v89.99,65.48 | v83.45,60.56 81.29,60.56 80.53,59.8 79.23,59.8 | v119.23,20.75 119.87,20.11 121.45,20.11 126.53,15.03 IC14.7 126.53,10.4 C47.1 123.36,9.06 123.36,8.05 122.09,6.78 117.64,6.78 116.37,8.05 IC11.4 114.34,7.98 C40.1 114.15,5.95 | v119.23,22.97 119.23,23.29 118.28,24.24 v118.28,26.78 | v119.87,28.69 119.68,28.88 IC12.4 119.36,30.66 C42.1 117.99,30.69 117.99,35.99 | R32.2 v37,45.51 | v37,49.32 37.32,49.64 47.16,49.64 48.75,51.23 48.75,55.36 | v129.07,38.53 141.14,38.53 v142.73,36.94 | v125.26,38.53 125.26,40.12 123.04,42.34 v122.41,42.34 | v120.5,42.34 117.2,42.34 | 119.29,35.99 117.99,35.99 | R168.2 148.22,42.43 v145.58,39.8 | v147.49,70.28 R174.2 C58.2 | v139.87,74.41 138.28,74.41 137.33,73.45 129.39,73.45 129.07,73.77 128.95,73.96 C51.1 125.65,73.71 IC15.4 124.31,75.04 123.99,75.36 v115.42,75.36
  Top 0.508: v111.29,84.25 v102.09,84.25 | v100.5,82.34 99.83,82.34 | R37.2 43.35,55.04 43.98,54.4 47.79,54.4 48.75,55.36 | 79.23,59.8 v73.83,59.8 | v71.61,59.8 67.16,59.8 | 67.16,59.8 63.99,59.8 v63.35,59.17 | v61.13,59.17 v56.37,59.17 | v54.14,59.17 52.56,59.17 48.75,55.36 | IC1.4 16.93,33.38 C1.1 17.82,31.67 v19.22,30.27 | v115.42,80.12 115.42,83.93 v115.1,84.25 | v25.89,30.27 25.89,31.86 29.38,35.35 29.38,39.48 v30.33,40.43 | v31.6,41.7 33.82,43.93 33.82,46.15 v34.46,46.78 | IC7.4 79.23,55.48 C24.1 79.23,55.86 79.23,59.8 | R113.2 v101.13,39.48 | v104.94,44.56 110.34,44.56 111.61,43.29 111.93,43.29 113.83,45.2 v115.42,45.2
  Bottom 0.508: v104.28,57.67 106.34,55.61 106.34,55.58 v106.75,55.17 | v94.12,67.36 93.55,66.79 v93.55,65.1 93.16,65.48 v89.99,65.48 | 87.83,84.95 v87.89,85.01 87.8,84.92 v87.8,82.98 | v86.85,61.68 86.85,63.39 v86.81,63.42 | v85.58,60.56 v83.45,60.56 | v119.23,20.75 v119.23,22.97 | v118.28,26.78 118.28,27.1 v119.87,28.69 | v129.07,38.53 v125.26,38.53 | v122.41,42.34 v120.5,42.34 | v145.58,39.8 v142.73,36.94 | v147.49,70.28 147.49,71.23 144.31,74.41 v139.87,74.41 | v115.1,84.25 v111.29,84.25 | v102.09,84.25 102.09,83.93 v100.5,82.34 | v73.83,59.8 v71.61,59.8 | v63.35,59.17 v61.13,59.17 | v56.37,59.17 v54.14,59.17 | v115.42,75.36 v115.42,80.12 | v19.22,30.27 v25.89,30.27 | v30.33,40.43 v31.6,41.7 | v37,45.51 37,46.78 | 37,46.78 v37,49.32 | v34.46,46.78 37,46.78 | v101.13,39.48 101.13,40.75 v104.94,44.56 | v115.42,45.2 v117.2,45.2
A2_IN
  Top 0.305: R182.P$2 157.65,85.04 154.44,88.25 152.82,88.25 150.98,90.09 146.6,90.09 143.87,87.36 R167.2
A_IN  (via drill 0.3)
  Top 0.305: 142.47,61.39 142.47,61.64 R163.2 142.53,61.71 142.53,63.1 143.23,63.8 v151.74,63.8 | R186.P$2 172.89,84.25 171.59,82.95 165.52,82.95 164.47,81.9 164.47,67.64 160.63,63.8 v155.52,63.8
  Bottom 0.305: v155.52,63.8 v151.74,63.8
AMPENVELOPEOUT  (via drill 0.3)
  Top 0.305: J13.TIP@3 167.8,32.23 167.59,32.02 | 167.59,32.02 165.46,29.89 165.46,24.37 159.17,18.08 132.12,18.08 129.11,15.07 | 129.11,15.07 129.11,12.81 | 129.11,12.81 129.11,12.27 IC14.5 | IC16.2 143.14,52.91 143.49,53.26 149.84,53.26 150.06,53.04 151.46,53.04 R169.2 152.54,50.47 v160.35,42.66 | 167.59,32.02 164.6,35 v164.6,38.4 | IC14.10 129.07,12.78 129.11,12.81 | 129.11,15.07 129.11,16.84 v127.74,18.21 | v127.74,19.83 127.52,19.83 124.41,22.94 120.69,22.94 119.71,23.92 119.71,25.74 IC12.5
  Bottom 0.305: v160.35,42.66 v164.6,38.4 | v127.74,18.21 v127.74,19.83
CUTOFF1_MODENVINPUT  (via drill 0.3)
  Top 0.305: R192.P$2 109.32,21.07 R136.P$1 | v111.29,15.67 110.34,15.67 R135.1 | v112.25,16.62 112.25,17.26 v111.61,17.89
  Bottom 0.305: v112.25,16.62 v111.29,15.67 | v111.61,17.89 109.39,20.11 R192.P$2
CUTOFF2_MODENVINPUT  (via drill 0.3)
  Top 0.305: R194.P$2 134.72,21.07 R160.P$1 130.63,23.57 129.71,22.65 v129.71,20.11 | v122.09,14.4 122.85,14.4 R152.1
  Bottom 0.305: v129.71,20.11 129.71,16.3 127.8,14.4 v122.09,14.4
CUTOFF_ENVELOPE
  Top 0.305: R144.2 114.35,11.92 IC11.1 114.41,14.01 R145.1
CUTOFF_ENVELOPE_2  (via drill 0.3)
  Top 0.305: R143.2 121.64,10.59 IC11.7 118.28,10.59 v117.96,10.27 | v112.25,8.37 111.61,8.37 109.07,10.91 109.07,16.94 v109.39,17.26 | v104.94,20.11 104.94,22.02 v102.09,24.88 | v102.09,29 102.09,29.45 R104.1 | v107.8,17.26 106.21,17.26 v104.94,18.53
  Bottom 0.305: v117.96,10.27 114.15,10.27 v112.25,8.37 | v104.94,18.53 v104.94,20.11 | v102.09,24.88 v102.09,29 | v109.39,17.26 v107.8,17.26
CUTOFF_IN  (via drill 0.3)
  Top 0.305: R106.1 102.69,33.13 104.12,34.56 104.12,42.78 102.24,44.66 102.24,49.01 v102.31,49.07 | R120.1 100.69,52.05 v102.31,52.05 102.28,52.09 102.28,54.56 105.07,57.36 105.07,60.82 103.8,62.09 103.8,64.82 112.6,73.61 112.6,82.69 120.37,90.47 v124.06,90.47 | J8.TIP@3 134.3,89.27 132.12,91.46 v125.36,91.46
  Bottom 0.305: v102.31,49.07 102.28,52.02 v102.31,52.05 | v125.36,91.46 125.04,91.46 v124.06,90.47
CUTOFF_INPUT  (via drill 0.3)
  Top 0.254: IC9.P$19 95.07,55.58 96.24,54.4 97.96,54.4 R121.1 R120.2 98.02,51.96 99.01,50.97 102.4,50.97 103.42,51.99 103.42,52.18 | R140.2 107.9,60.21 R138.2 107.93,59.13 103.42,54.63 103.42,52.18 | R145.2 R146.2 112.25,15.67 v110.34,17.57 | v104.62,50.91 103.04,49.32 103.04,46.78 104.31,45.51 104.31,44.24 105.26,43.29 109.39,43.29 110.66,42.02 v110.66,40.12 | v110.66,36.94 110.98,36.94 111.61,36.31 111.61,33.77 v106.85,29 | v106.53,25.19 104.94,23.61 104.94,22.65 105.58,22.02 105.58,20.75 106.53,19.8 107.48,19.8 v107.8,20.11 | v103.36,52.18 103.42,52.18
  Bottom 0.254: v104.62,50.91 v103.36,52.18 | v110.66,36.94 v110.66,40.12 | v106.85,29 106.85,25.51 v106.53,25.19 | v110.34,17.57 v107.8,20.11
CUTOFF_KEYTRACK  (via drill 0.3)
  Top 0.305: IC15.1 120.5,71.36 R150.2 117.96,71.23 117.64,70.91 v117.64,69.01 | v103.99,33.45 104.31,33.45 108.44,37.58 112.56,37.58 113.2,36.94 | R109.1 v103.04,34.4 | 113.2,36.94 114.79,35.35 114.79,32.18 115.74,31.23 115.74,27.1 117.64,25.19 v117.64,22.97 | v114.15,17.57 114.15,15.67 R146.1 | v113.83,61.07 117.64,64.88 v117.64,65.52 | v113.83,55.99 v113.83,59.17 | v113.83,54.4 113.83,50.91 110.98,48.05 110.98,46.78 v112.56,45.2 | v114.47,43.29 114.47,39.48 v114.79,39.16 | 113.2,36.94 v113.2,36.62
  Bottom 0.305: v103.04,34.4 v103.99,33.45 | v117.64,22.97 117.64,21.07 v114.15,17.57 | v113.83,59.17 v113.83,61.07 | v113.83,54.4 v113.83,55.99 | v114.47,43.29 v112.56,45.2 | v114.79,39.16 114.79,38.53 113.2,36.94 v113.2,36.62 | v117.64,69.01 v117.64,65.52
CUTOFF_KNOB
  Top 0.305: R141.P$2 109.39,61.64 | 109.39,61.64 R140.1 | 109.39,61.64 109.39,61.55 108.69,60.85 108.69,58.72 104.12,54.15 104.12,51.83 101.67,49.39 101.67,44.28 103.42,42.53 103.42,36.59 102.56,35.73 101.01,35.73 R110.1
CUTOFF_KNOB_2  (via drill 0.3)
  Top 0.305: R165.P$2 134.79,64.25 132.25,61.71 v132.25,61.07 | v130.98,59.8 130.98,51.55 128.12,48.69 v128.12,31.86 | v126.53,30.27 124.95,28.69 121.14,28.69 v120.5,29.32 | v115.1,27.42 100.18,27.42 99.86,27.73 99.86,29.64 100.18,29.96 100.18,31.23 100.82,31.86 R105.1
  Bottom 0.305: v130.98,59.8 v132.25,61.07 | v126.53,30.27 v128.12,31.86 | v120.5,29.32 119.55,29.32 118.91,29.96 117.64,29.96 v115.1,27.42
CV_RACK  (via drill 0.3)
  Top 0.305: J14.13 J14.14 13.69,73.77 12.33,72.41 12.33,70.95 9.09,67.71 5.98,67.71 v3.22,70.47 | J3.SWITCH@3 1.75,91.44 v1.75,72.18
  Bottom 0.305: v1.75,72.18 3.22,70.72 v3.22,70.47
D2_IN
  Top 0.305: R181.P$2 157.65,77.3 154.06,80.88 152.63,80.88 152.09,81.42 152.09,87.93 150.69,89.33 148.34,89.33 147.9,88.88 R177.2
D_IN  (via drill 0.3)
  Top 0.305: R185.P$2 172.89,69.74 171.33,71.3 169.17,71.3 160.76,62.88 156.22,62.88 v156.16,62.82 | v153.65,62.91 147.96,62.91 147.62,62.56 147.62,61.71 R172.2
  Bottom 0.305: v156.16,62.82 153.74,62.82 v153.65,62.91
EXP_FM_IN  (via drill 0.3)
  Top 0.305: S1.3 7.79,33.92 5.5,36.21 5.5,39.07 6.61,40.18 13.82,40.18 15.15,41.51 26.55,41.51 v26.81,41.42 | v26.81,43.1 26.81,45.83 | 26.81,45.83 26.81,48.53 R15.1 | R53.1 v50.02,49.32 | 26.81,45.83 31.5,45.83 35.98,50.31 46.21,50.31 46.81,50.91 v46.84,50.91
  Bottom 0.305: v26.81,41.42 v26.81,43.1 | v50.02,49.32 48.43,49.32 v46.84,50.91
FILTER_IN  (via drill 0.3)
  Top 0.305: R96.2 90.15,64.53 91.48,65.87 99.2,65.87 v100.5,64.56 | v133.52,2.65 130.03,2.65 127.8,4.87 IC14.9 | v134.79,3.6 136.38,2.02 147.17,2.02 152.57,7.41 J9.TIP@3
  Bottom 0.305: v134.79,3.6 134.47,3.6 v133.52,2.65 | v100.5,64.56 119.55,45.51 119.55,41.86 129.07,32.34 132.25,32.34 152.57,12.02 J9.TIP@3
FILTER_OUT  (via drill 0.3)
  Top 0.305: R107.1 92.88,30.57 | 92.88,30.57 C33.- v91.93,30.59 | 92.88,30.57 92.88,28.24 95.23,25.89 112.5,25.89 v115.42,22.97 | IC14.6 127.68,12.11 127.68,11.67 127.77,11.76 127.77,16.75 123.14,21.38 115.74,21.38 v115.42,21.07
  Bottom 0.305: v91.93,30.59 91.77,30.43 TP7.P$1 | v115.42,22.97 v115.42,21.07
GATE_IN  (via drill 0.3)
  Top 0.305: IC17.4 145.2,71.93 C59.1 145.08,71.04 146.6,69.52 146.6,67.23 145.9,66.53 142.6,66.53 135.84,59.77 132.38,59.77 132.26,59.88 | IC16.4 145.68,47.32 C56.1 145.42,43.7 143.71,41.99 141.39,41.99 v136.98,46.4 | D1.2 4.71,75.45 S2.1 4.96,75.99 3.66,77.3 3.66,79.49 4.45,80.28 | 4.45,80.28 S2.2 | 132.26,59.88 129.01,63.13 129.01,65.58 126.22,68.37 113.2,68.37 v110.98,70.6 | v134.85,46.4 134.72,46.4 133.17,47.96 133.17,50.18 131.49,51.86 131.49,59.1 132.26,59.88 | v109.07,88.69 110.98,86.79 112.25,86.79 113.52,85.52 113.52,84.88 111.93,83.3 111.93,74.09 v109.71,71.87 | v107.8,89.96 107.48,89.96 98.28,99.17 80.81,99.17 78.27,96.63 74.46,96.63 71.92,99.17 47.79,99.17 45.25,96.63 41.76,96.63 39.54,98.85 29.7,98.85 27.47,96.63 23.66,96.63 21.44,98.85 12.87,98.85 9.38,95.36 9.38,91.55 10.64,90.28 10.64,89.01 9.38,87.74 3.98,87.74 3.34,87.11 3.34,81.39 4.45,80.28
  Bottom 0.305: v136.98,46.4 v134.85,46.4 | v109.07,88.69 v107.8,89.96 | v110.98,70.6 v109.71,71.87
GATE_RACK
  Top 0.305: J14.15 J14.16 11.49,68.26 J2.SWITCH@3
GATELED  (via drill 0.3)
  Top 0.305: IC12.7 IC12.6 121.14,25.58 v121.14,23.92 | v1.12,27.73 1.12,5.51 5.25,1.38 20.49,1.38 23.34,4.24 27.79,4.24 29.06,2.97 39.54,2.97 41.13,4.56 50.33,4.56 52.56,2.33 71.29,2.33 73.83,4.87 80.81,4.87 83.67,2.02 98.28,2.02 108.44,12.18 108.44,17.57 109.07,18.21 110.98,18.21 112.25,19.48 118.28,19.48 119.55,18.21 v121.14,18.21 | v2.07,29.64 v2.07,54.09 | v11.28,72.5 11.28,74.72 8.42,74.72 7.79,75.36 S2.LEDPOS | v8.42,66.79 8.42,66.47 3.66,61.71 v3.66,55.99
  Bottom 0.305: v121.14,23.92 v121.14,18.21 | v1.12,27.73 2.07,28.69 v2.07,29.64 | v2.07,54.09 3.66,55.67 v3.66,55.99 | v8.42,66.79 11.28,69.64 v11.28,72.5
GND  (via drill 0.3)
  Top 0.254: v90.34,58.85 IC9.P$7 | IC8.P$7 v92.5,42.15
  Top 0.508: v20.17,31.7 19.38,32.5 C1.2 | v21.76,33.29 21.76,33.77 22.07,34.08 IC1.5 | v20.17,38.53 19.85,38.85 19.85,39.48 C2.1 | 10.64,56.31 11.28,56.31 IC2.6 | 10.64,56.31 10.01,56.31 IC2.7 | 12.39,48.53 12.39,49.8 12.55,49.96 IC2.10 | 12.39,48.53 12.39,47.58 C4.2 | v12.71,57.9 13.5,58.69 C8.2 | v12.71,48.53 12.39,48.53 | IC2.8 10.01,49.32 v10.64,48.69 | v13.82,57.74 IC2.4 | v10.64,57.58 10.64,56.31 | 42.55,56.94 43.03,56.94 R39.2 | 42.55,56.94 R38.2 | v36.52,40.43 37.32,41.23 R29.2 | v36.52,43.61 37.16,44.24 R31.2 | v33.98,50.43 33.98,50.59 34.62,51.23 C9.1 | v42.55,56.31 42.55,56.94 | v100.5,54.56 99.55,54.56 R121.2 | v99.7,58.85 99.07,58.85 98.91,59.01 C37.2 | v92.72,67.74 93.51,68.53 C38.2 | v19.54,54.88 19.54,53.93 C5.2 | v22.71,54.88 21.92,55.67 C6.1 | v20.8,45.51 21.76,45.51 C3.1 | v24.93,53.61 25.73,54.4 R20.1 | v77.32,54.88 77.48,55.67 C24.2 | v69.54,56.94 68.75,57.74 C22.2 | IC5.12 67.48,54.88 v67.8,55.2 | v70.02,55.2 IC5.10 | v140.5,60.91 141.14,61.55 R162.2 | C54.1 v141.14,67.74 | R67.1 70.18,39.48 v71.13,38.53 | v75.42,37.73 76.21,38.53 R79.1 | IC13.3 121.45,53.93 C44.2 121.61,54.24 v122.25,54.88 | R170.2 145.11,61.71 146.22,61.71 R171.1 146.38,61.87 v146.38,62.66 | C31.1 C30.1 86.69,57.42 v85.89,57.42 | C25.1 87,24.24 86.53,23.77 v86.53,23.61 IC6.6 | v97.96,16.94 97.16,16.14 C32.2 | v101.93,36.94 R111.2 | v115.74,7.1 115.74,6.14 C40.2 | v118.12,12.81 118.12,13.76 C41.1 | v125.58,8.84 C47.2 | v126.22,27.73 125.58,27.73 C48.1 | v125.74,2.33 126.53,3.13 C46.2 | v130.34,5.35 131.14,4.56 R151.2 | v24.77,59.48 C10.2 | v5.41,82.34 4.77,82.98 R2.2 | v63.99,37.1 64.78,37.89 R64.1 | v58.43,39.48 58.43,40.43 C17.2 | v61.76,42.02 61.76,42.97 C18.1
  Top 0.508: v68.75,43.13 C20.2 | v83.83,43.61 83.04,44.4 C28.1 | v123.52,40.43 C49.1 | v136.85,11.54 136.06,10.75 C52.1 | v135.42,13.92 134.63,14.72 R159.2 | v141.14,45.51 141.77,44.88 C53.1 | v59.38,45.51 R49.1 | v118.6,48.53 118.6,49.48 C43.2 | v124.95,48.21 125.74,49.01 C50.1 | v61.29,49.96 C21.1 | v150.82,42.66 150.03,43.45 C55.1 | v119.87,77.42 118.91,77.42 C45.1 | v126.69,76.31 125.9,75.52 C51.2 | v30.33,80.44 30.33,81.39 C12.2 | v94.31,82.34 93.51,81.55 C39.2 | C14.2 34.3,84.73 v33.66,84.09 33.35,83.77 32.55,83.77 C13.+ | v141.61,85.84 140.98,85.2 R166.2 | R175.2 144.47,84.41 v144.47,84.25 144,83.77 144,81.71 IC17.14 | v145.9,86.79 146.54,87.42 R176.1 | v148.76,68.06 147.96,67.26 C58.1 | v150.03,70.91 C60.1 149.08,72.03 149.08,75.04 IC17.7 | v150.03,88.38 149.23,87.58 C61.2 | v27.31,79.33 C11.- | v124.47,38.21 124.47,37.1 U1.1 | v83.19,22.02 83.99,22.02 IC6.8 | v67.48,46.62 IC5.3 | v70.02,46.62 IC5.5 | v93.04,74.88 92.24,74.09 IC10.10 92.24,71.55 v92.56,71.23 | v92.24,79.33 IC10.5 | v94.78,79.33 IC10.3 | v119.71,46.78 120.18,46.78 IC13.5 | v134.95,12.33 134.15,12.33 IC14.1 | IC4.12 52.87,42.97 v53.51,42.34 | v27.79,58.21 IC3.12 | v149.55,47.89 149.55,50.43 IC16.7 | IC10.12 v94.78,71.23 | C36.2 v95.1,50.28 | IC16.14 144.41,58.75 v144.31,58.85 | C57.1 148.85,61.48 v148.76,61.39 | C42.2 118.47,29.13 v118.6,29 | IC7.5 79.23,47.42 v78.91,47.1 | IC7.6 80.5,49.32 v80.81,49.64
  Bottom 0.508: JP3.1 | v148.76,61.39 149.08,61.07 | v78.91,47.1 78.59,46.78 | v80.81,49.64 81.13,49.64
  other vias: 90.97,58.85 91.86,42.15
  pour Bottom: 187.24,121.94 186.38,28.59 182.03,-4.65 -3.01,-4.65 -7.86,104.16
  pour Top: 92.78,42.4 92.78,42.31 92.24,41.77
HARDSYNC_2_IN  (via drill 0.3)
  Top 0.305: v38.59,39.16 38.74,39.64 C15.2
  Bottom 0.305: v38.59,39.16 38.59,38.53 41.44,35.67 41.44,29 43.03,27.42 49.7,27.42 56.37,20.75 56.37,7.41 S3.3
HARDSYNC_IN
  Top 0.305: C23.2 60.94,89.68 61.06,89.81 61.06,89.34 J4.TIP@3
HP_FILTER_CUTOFF_IN
  Top 0.254: IC8.P$19 97.05,39.18 97.99,38.24 99.39,38.24 R112.1
  Top 0.305: R104.2 R105.2 R106.2 R109.2 R110.2 R111.1 R112.1
HP_RESONANCE_IN  (via drill 0.3)
  Top 0.305: R108.2 94.15,28.37 95.73,26.78 115.1,26.78 v117.01,24.88 | v124.95,29.96 125.26,29.96 126.53,31.23 126.53,41.07 v126.22,41.39 | v129.07,41.39 129.71,41.39 131.61,43.29 132.85,43.29 R161.P$2
  Bottom 0.305: v117.01,24.88 119.23,24.88 120.18,25.83 120.82,25.83 v124.95,29.96 | v126.22,41.39 v129.07,41.39
LINEAR_FM_IN  (via drill 0.3)
  Top 0.305: S1.1 7.79,51.55 8.42,52.18 v15.09,52.18 | v21.12,56.94 C7.2 | v61.45,45.99 61.76,45.67 61.76,44.24 C19.2 | v47.63,52.02 42.55,52.02 42.24,51.7 35.57,51.7 34.78,52.5 34.3,52.5 32.87,53.93 32.87,55.99 32.55,56.31 v27.63,56.31
  Bottom 0.305: v15.09,52.18 15.09,53.13 18.9,56.94 v21.12,56.94 21.76,56.31 v27.63,56.31 | v61.45,45.99 60.02,47.42 54.3,47.42 49.7,52.02 v47.63,52.02
LP_TO_HP  (via drill 0.3)
  Top 0.305: R90.1 88.95,50.66 C29.- 85.58,50.48 85.58,44.21 86.24,43.54 v87.29,43.54 | v88.72,43.51 88.75,43.48 88.75,40.37 88.5,40.12 C26.1 87.93,40.05 85.96,40.05 v85.89,40.12
  Bottom 0.305: v88.72,43.51 87.32,43.51 v87.29,43.54 | TP8.P$1 85.89,38.85 v85.89,40.12
MAIN_CV  (via drill 0.3)
  Top 0.305: v17.19,52.69 16.96,52.91 5.03,52.91 1.75,56.18 1.75,70.6 2.71,71.55 2.71,88.06 3.92,89.27 5.41,89.27 | 5.41,89.27 J3.TIP@3 | v24.3,47.74 R14.1 | v18.9,50.94 18.9,50.91 19.54,50.28 v19.54,47.74 | R158.P$3 127.21,76.91 127.48,76.63 v127.48,74.72 | v127.48,72.82 126.98,72.82 R155.1 | v56.21,57.9 57.48,57.9 59.22,56.15 59.22,55.2 58.43,54.4 R57.1 | v100.02,91.39 70.02,91.39 62.71,98.7 48.11,98.7 45.41,96 v43.35,96 | v40.97,98.38 40.01,99.33 29.38,99.33 27.63,97.58 23.5,97.58 21.76,99.33 6.99,99.33 5.41,97.74 5.41,89.27
  Bottom 0.305: v17.19,52.69 17.19,52.66 v18.9,50.94 | v19.54,47.74 v24.3,47.74 25.89,46.15 28.43,46.15 30.01,47.74 30.01,52.66 33,55.64 33.85,55.64 43.51,65.29 45.79,65.29 53.19,57.9 v56.21,57.9 | v127.48,74.72 v127.48,72.82 | v100.02,91.39 122.09,91.39 126.37,87.11 127.17,87.11 R158.P$3 | v40.97,98.38 v43.35,96
MIXER_SUMLINE  (via drill 0.3)
  Top 0.305: R77.2 66.19,20.83 64.84,19.48 63.22,19.48 R62.2 50.24,20.75 49.13,19.64 47.82,19.64 R44.2 34.68,20.75 R10.2 33.65,19.8 29.7,19.8 24.62,24.88 R12.1 24.49,35.35 IC1.6 20.49,35.35 20.17,35.67 20.17,37.58 18.58,39.16 v10.33,39.16 | v5.25,40.12 3.34,42.02 v3.34,52.82 | v4.61,54.4 6.52,56.31 6.52,58.53 8.42,60.44 9.69,60.44 v12.23,62.98 | v15.09,65.83 16.04,66.79 21.12,66.79 24.93,70.6 24.93,72.5 28.74,76.31 28.74,78.85 29.7,79.8 30.65,79.8 31.92,81.07 33.95,81.07 R25.2 40.46,80.12 41.92,81.58 50.33,81.58 | 50.33,81.58 61.76,81.58 | 61.76,81.58 75.73,81.58 R88.2 | R61.2 50.46,81.45 50.33,81.58 | R75.2 61.95,81.39 61.76,81.58
  Bottom 0.305: v10.33,39.16 9.38,40.12 v5.25,40.12 | v3.34,52.82 4.61,54.09 v4.61,54.4 | v12.23,62.98 v15.09,65.83
MODENVOUT  (via drill 0.3)
  Top 0.305: IC17.2 142.66,74.66 | 136.98,19.07 126.95,19.07 123.96,22.05 112.91,22.05 R192.P$3 111.93,21.04 110.25,19.35 102.85,19.35 R191.P$3 | R194.P$3 137.33,19.42 136.98,19.07 | R193.P$3 111.93,95.84 113.96,97.87 120.22,97.87 123.04,95.04 123.04,92.63 125.39,90.28 131.9,90.28 133.61,88.57 133.61,81.39 136.79,78.22 141.9,78.22 142.69,77.42 142.69,74.69 142.66,74.66 | 142.66,74.66 142.66,72.41 143.3,71.77 143.3,69.01 R173.2 143.68,68.63 v143.68,68.06 | 136.98,19.07 148.85,19.07 157.65,27.86 J11.TIP@3 153.89,35.99 145.27,35.99 135.74,45.51 135.74,50.28 137.65,52.18 v137.65,60.12
  Bottom 0.305: v143.68,68.06 145.27,66.47 145.27,62.98 142.41,60.12 v137.65,60.12
N$1
  Top 0.305: IC16.15 143.14,58.88 142.44,59.58 142.44,60.09 R163.1 R162.1
N$2
  Top 0.305: IC16.12 146.95,59.83 146.89,59.9 146.57,59.9 R171.2 R172.1
N$3
  Top 0.305: IC16.13 145.62,56.97 145.62,58.94 145.04,59.52 R170.1 R164.1
N$4
  Top 0.305: IC16.1 141.87,46.34 C53.2
N$5
  Top 0.305: C46.1 IC14.8
N$6
  Top 0.305: IC16.5 C56.2
N$7
  Top 0.508: J14.10 J14.9 D2.1
N$8
  Top 0.508: J14.2 16.39,89.01 | 16.39,89.01 J14.1 | 16.39,89.01 16.42,88.98 19.25,88.98 20.17,88.06 20.17,84.15 D3.2
N$9
  Top 0.305: IC16.6 R168.1
N$10
  Top 0.305: IC16.8 150.76,45.89 C55.2
N$11
  Top 0.305: IC16.10 149.49,54.66 150.47,53.67 152.35,53.67 R169.1
N$12
  Top 0.305: IC14.3 IC14.4
N$13
  Top 0.305: IC14.2 132.88,14.72 R159.1 135.61,17.26 160.82,17.26 165.27,12.81 J10.TIP@3
N$14
  Top 0.305: IC14.13 132.88,4.56 R151.1 136.19,1.06 169.08,1.06 175.43,7.41 J12.TIP@3
N$15
  Top 0.305: IC14.12 IC14.11
N$16
  Top 0.305: R6.2 C3.2
N$17
  Top 0.254: IC9.P$24 96.03,58.51 96.53,59.01 97.23,59.01 C37.1
N$18
  Top 0.254: IC9.P$8 89.81,58.01 89.04,58.79 C31.2
N$19
  Top 0.254: IC9.P$9 C30.2
N$20
  Top 0.254: IC9.P$17 93.57,53.94 94.15,53.36 94.53,53.36 94.97,52.91 C36.1
N$21
  Top 0.254: IC9.P$15 92.57,52.31 R118.1
N$22
  Top 0.305: S2.LEDNEG 7.79,81.52 R2.1
N$23
  Top 0.254: R96.1 R125.1 91.42,61.45 91.67,61.2 92.15,61.2 92.57,60.78 IC9.P$4
N$24  (via drill 0.3)
  Top 0.254: IC9.P$12 90.57,55.49 90.05,54.97 89.48,54.97 | 89.48,54.97 R91.2 | R125.2 91.42,63.23 v91.32,63.13 | v89.48,55.48 89.48,54.97
  Bottom 0.254: v91.32,63.13 91.29,63.13 89.48,61.33 v89.48,55.48
N$25  (via drill 0.3)
  Top 0.254: IC9.P$11 89.43,56.51 89.16,56.25 R93.2 88.18,56.25 87.61,55.67 87.61,54.4 87.29,54.09 85.29,54.09 84.21,55.17 84.21,62.53 88.18,66.5 v95.39,66.5 | R124.1 98.69,61.83 v95.39,65.14
  Bottom 0.254: v95.39,65.14 v95.39,66.5
N$26  (via drill 0.3)
  Top 0.305: IC9.P$3 93.07,61.96 R126.1 R127.2 94.34,61.96 v94.82,61.96 | R119.2 93.7,49.64 v93.96,49.39
  Bottom 0.305: v93.96,49.39 96.05,49.39 97.77,51.1 97.77,52.82 96.88,53.71 96.4,53.71 95.04,55.07 95.04,61.74 v94.82,61.96
N$27  (via drill 0.3)
  Top 0.254: R123.2 99.61,57.77 100.31,58.47 R124.2 | R124.2 R139.1 | IC9.P$2 93.57,60.49 93.86,60.79 96.02,60.79 v96.05,60.75 | 100.28,60.34 R124.2 | v98.05,60.75 99.86,60.75 R124.2
  Bottom 0.254: v96.05,60.75 v98.05,60.75
N$28
  Top 0.254: IC9.P$23 96.26,58.01 96.5,57.77 R123.1 97.74,57.77 97.99,58.02 97.99,59.83 R127.1
N$29
  Top 0.254: IC9.P$20 96.04,56.51 96.82,55.74 R122.2
N$30
  Top 0.254: IC9.P$16 93.07,53.65 93.7,53.01 R119.1 93.7,51.67 93.96,51.42 95.7,51.42 96.12,51.01 96.12,49.16 95.7,48.75 88.25,48.75 C29.+
N$31
  Top 0.305: R21.2 C6.2
N$32
  Top 0.254: IC9.P$14 92.07,53.94 91.16,53.04 R90.2
N$33
  Top 0.254: IC9.P$5 92.07,60.42 91.93,60.56 R95.2 88.4,60.59 88.4,61.74 87.54,62.59 85.7,62.59 84.81,61.71 84.81,56.72 85.29,56.25 R93.1 R91.1
N$34
  Top 0.305: IC3.13 R22.2 | R23.2 R22.2 | R22.2 R21.1
N$35
  Top 0.305: R22.1 C7.1
N$36
  Top 0.305: IC3.11 C10.1
N$37  (via drill 0.3)
  Top 0.305: IC3.9 v25.89,62.02
  Bottom 0.305: v25.89,62.02 25.69,62.22 TP3.P$1
N$38
  Top 0.305: IC3.14 28.55,55.67 R20.2
N$39
  Top 0.305: IC1.7 24.49,36.62 R12.2 R13.1
N$40
  Top 0.305: R87.P$2 78.91,79.93 R88.1
N$41
  Top 0.305: S1.2 7.98,38.09 R4.2 14.52,37.89 IC1.1
N$42  (via drill 0.3)
  Top 0.305: IC3.6 38.59,59.48 41.13,62.02 v41.13,73.45 | v47.79,80.76 42.39,80.76 41.13,79.49 v41.13,74.72 | v47.79,85.2 50.97,85.2 52.24,86.47 C23.1
  Bottom 0.305: v47.79,85.2 v47.79,80.76 | v41.13,74.72 v41.13,73.45
N$43
  Top 0.305: IC3.1 38.27,53.13 38.9,52.5 R35.1
N$44
  Top 0.305: R35.2 44.62,52.5 R190.P$3
N$45  (via drill 0.3)
  Top 0.305: IC3.3 39.86,55.67 R36.2 41.79,55.48 | R190.P$2 R190.P$1 | R37.1 41.79,55.48 | 41.79,55.48 v41.79,54.82
  Bottom 0.305: v41.79,54.82 41.79,54.88 42.46,55.55 45.13,55.55 R190.P$2
N$46  (via drill 0.3)
  Top 0.305: R188.P$2 33.51,54.24 v33.54,54.21 | v31.7,52.02 31.7,48.91 31.35,48.56 R18.2
  Bottom 0.305: v33.54,54.21 33.54,53.86 v31.7,52.02
N$47
  Top 0.305: IC3.2 39.86,54.4 R36.1
N$48